# EAGLE design pcb1a (EAGLE 9.6.2)
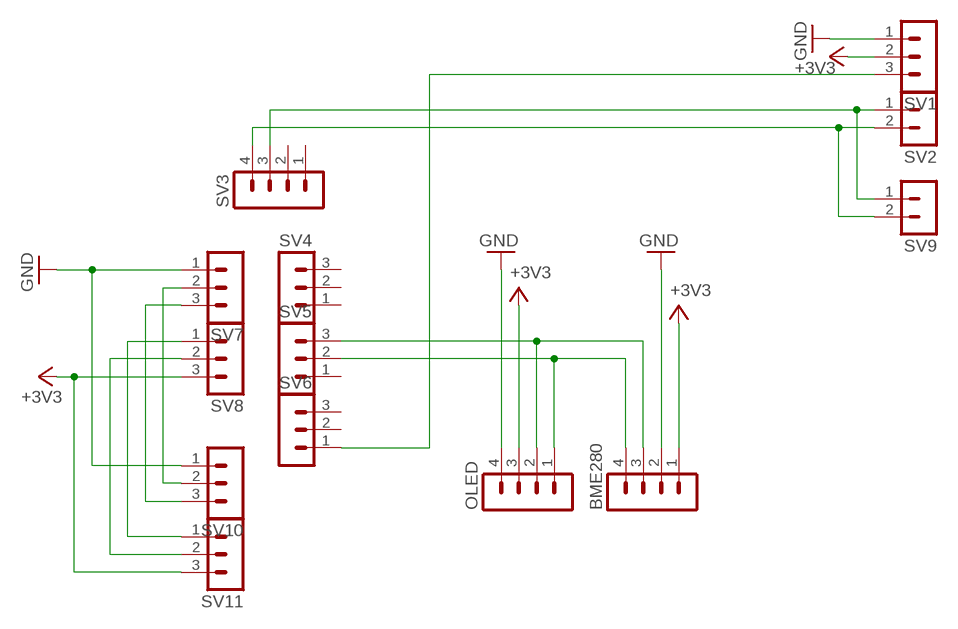
[diagram p0: schematic, sheet 1]

## Parts
BME280  PINHEAD-MA04-1  [PINHEAD-MA04-1]
OLED  PINHEAD-MA04-1  [PINHEAD-MA04-1]
SV1  PINHEAD-MA03-1  [PINHEAD-MA03-1]
SV2  PINHEAD-MA02-1  [PINHEAD-MA02-1]
SV3  PINHEAD-MA04-1  [PINHEAD-MA04-1]
SV4  PINHEAD-MA03-1  [PINHEAD-MA03-1]
SV5  PINHEAD-MA03-1  [PINHEAD-MA03-1]
SV6  PINHEAD-MA03-1  [PINHEAD-MA03-1]
SV7  PINHEAD-MA03-1  [PINHEAD-MA03-1]
SV8  PINHEAD-MA03-1  [PINHEAD-MA03-1]
SV9  PINHEAD-MA02-1  [PINHEAD-MA02-1]
SV10  PINHEAD-MA03-1  [PINHEAD-MA03-1]
SV11  PINHEAD-MA03-1  [PINHEAD-MA03-1]

## Nets
+3V3: BME280.1 OLED.3 SV1.2 SV8.3 SV11.3
GND: BME280.2 OLED.4 SV1.1 SV7.1 SV10.1
N$1: SV1.3 SV6.1
N$2: BME280.3 OLED.2 SV5.3
N$3: BME280.4 OLED.1 SV5.2
N$4: SV7.2 SV10.2
N$5: SV2.2 SV3.4 SV9.2
N$6: SV2.1 SV3.3 SV9.1
N$7: SV7.3 SV10.3
N$8: SV8.1 SV11.1
N$9: SV8.2 SV11.2
Unconnected: SV3.1 SV3.2 SV4.1 SV4.2 SV4.3 SV5.1 SV6.2 SV6.3

## Library data of the parts
BME280 OLED SV3 = ytani1:PINHEAD-MA04-1: PIN HEADER; OC_FARNELL: unknown; OC_NEWARK: unknown
SV1 SV4-SV8 SV10 SV11 = ytani1:PINHEAD-MA03-1: PIN HEADER; OC_FARNELL: unknown; OC_NEWARK: unknown
SV2 SV9 = ytani1:PINHEAD-MA02-1: PIN HEADER

## Board
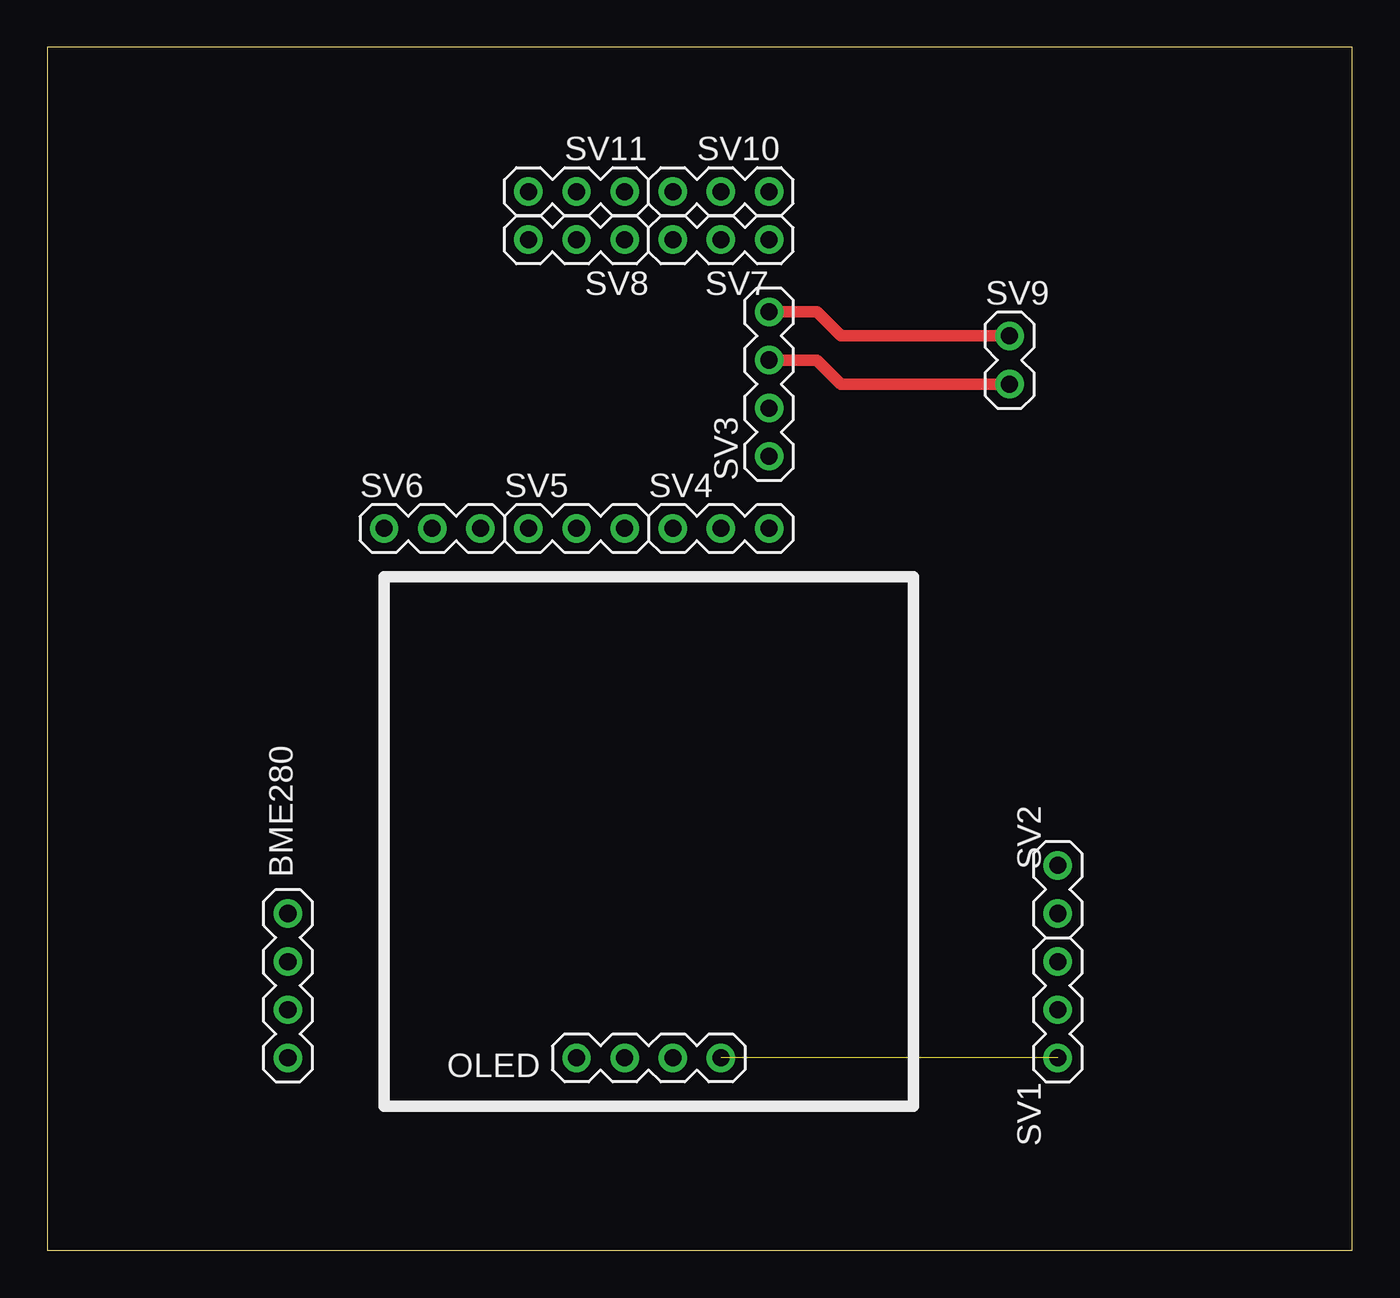
[diagram p1: board, top side]
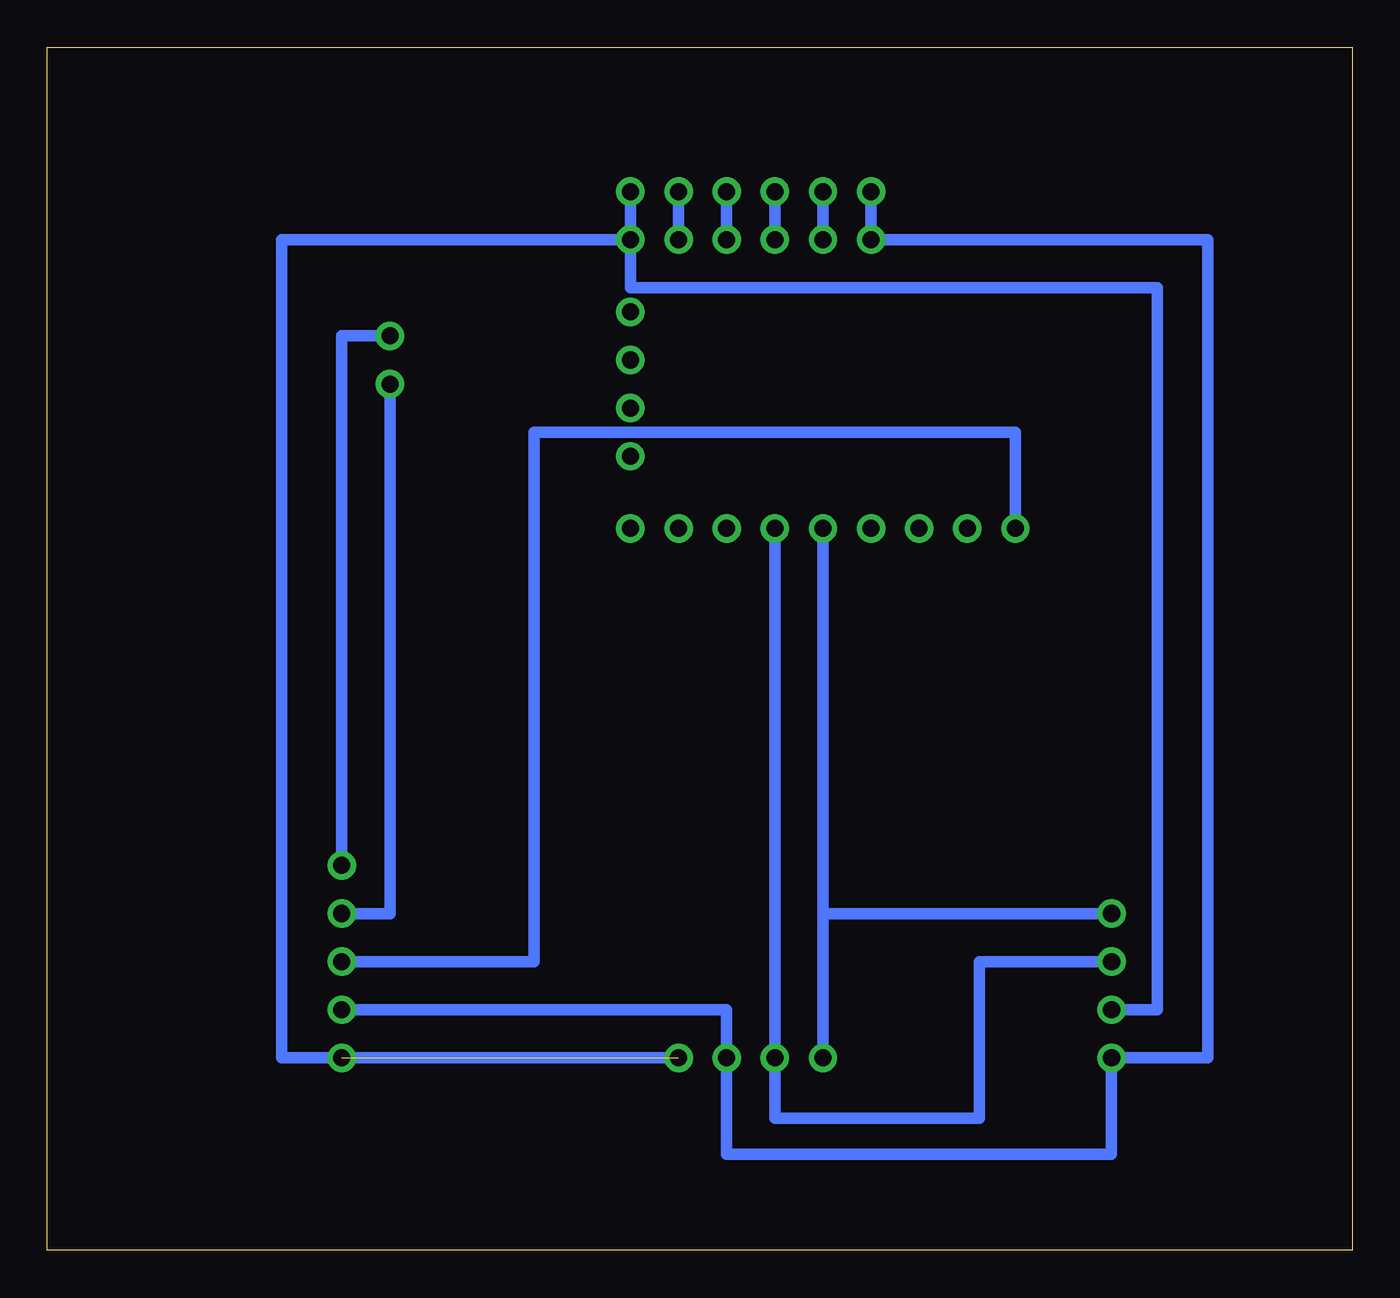
[diagram p2: board, bottom side, seen from below]

Size 68.89 x 63.49 mm. Coordinates in mm from the lower left corner, seen from the top.
Outline: 0,0 68.89,0 68.89,63.49 0,63.49 0,0
Copper layers (1*16): Top 0.035mm / dielectric 1.5mm / Bottom 0.035mm
Design rules "default": minimum track width 6mil, minimum drill 0.35mm, track to track 6mil, track to pad 6mil, pad to pad 6mil, via to via 6mil, smd to smd 6mil, copper to edge 40mil, drill to drill 6mil, minimum pad ring 10mil, minimum via ring 8mil, stop-mask expansion 4mil, vias tented up to drill 0mil, thermal gap 10mil

### Footprints (pad centres in the part's own frame; a part is rotated, then mirrored left to right if it is on the bottom)
PINHEAD-MA04-1 = drill 0.9 pad 1.5: 1 -3.81,0; 2 -1.27,0; 3 1.27,0; 4 3.81,0
PINHEAD-MA03-1 = drill 0.9 pad 1.5: 1 -1.27,0; 2 1.27,0; 3 3.81,0
PINHEAD-MA02-1 = drill 0.9 pad 1.5: 1 -1.27,0; 2 1.27,0

### Placement (x,y rotation side)
BME280  12.7,13.97 90 top
OLED  31.75,10.16 0 top
SV1  53.34,11.43 90 top
SV2  53.34,19.05 90 top
SV3  38.1,45.72 90 top
SV4  34.29,38.1 0 top
SV5  26.67,38.1 0 top
SV6  19.05,38.1 0 top
SV7  36.83,53.34 180 top
SV8  29.21,53.34 180 top
SV9  50.8,46.99 90 top
SV10  36.83,55.88 180 top
SV11  29.21,55.88 180 top

### Tracks (layer width: path | path; a pad name or v marks a point on that pad's centre or on a via)
+3V3
  Bottom 0.61: SV11.3 SV8.3 7.62,53.34 7.62,10.16 BME280.1 12.7,5.08 33.02,5.08 OLED.3 33.02,12.7 SV1.2
GND  (1 unrouted)
  Bottom 0.61: SV7.1 SV10.1 | SV7.1 56.52,53.34 56.52,10.16 SV1.1 OLED.4 | SV7.1 38.1,50.8 10.29,50.8 10.29,12.7 BME280.2
N$1
  Bottom 0.61: SV6.1 17.78,43.18 43.18,43.18 43.18,15.24 SV1.3
N$2
  Bottom 0.61: SV5.3 OLED.2 30.48,6.99 19.68,6.99 19.68,15.24 BME280.3
N$3
  Bottom 0.61: SV5.2 OLED.1 27.94,17.78 BME280.4
N$4
  Bottom 0.61: SV7.2 SV10.2
N$5
  Top 0.61: SV3.4 40.64,49.53 41.91,48.26 SV9.2
  Bottom 0.61: SV2.2 53.34,48.26 SV9.2
N$6
  Top 0.61: SV3.3 40.64,46.99 41.91,45.72 SV9.1
  Bottom 0.61: SV2.1 50.8,17.78 SV9.1
N$7
  Bottom 0.61: SV7.3 SV10.3
N$8
  Bottom 0.61: SV8.1 SV11.1
N$9
  Bottom 0.61: SV8.2 SV11.2